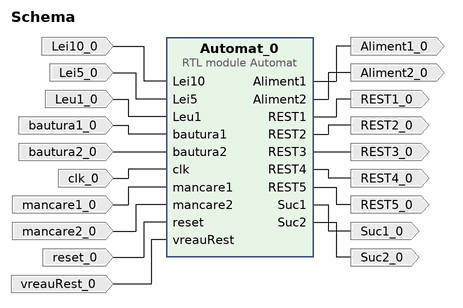
[diagram p0: block diagram of the top level]
# Vivado block design Schema, xc7a100tcsg324-1, Vivado 2020.2
create_bd_design Schema

create_bd_port -dir O Aliment1_0
create_bd_port -dir O Aliment2_0
create_bd_port -dir I Lei10_0
create_bd_port -dir I Lei5_0
create_bd_port -dir I Leu1_0
create_bd_port -dir O REST1_0
create_bd_port -dir O REST2_0
create_bd_port -dir O REST3_0
create_bd_port -dir O REST4_0
create_bd_port -dir O REST5_0
create_bd_port -dir O Suc1_0
create_bd_port -dir O Suc2_0
create_bd_port -dir I bautura1_0
create_bd_port -dir I bautura2_0
create_bd_port -dir I -type clk clk_0
create_bd_port -dir I mancare1_0
create_bd_port -dir I mancare2_0
create_bd_port -dir I -type rst reset_0
create_bd_port -dir I vreauRest_0

create_bd_cell -type module -reference Automat Automat_0

# ---- connections ----

connect_bd_net [get_bd_pins Automat_0/Aliment1] [get_bd_ports Aliment1_0]
connect_bd_net [get_bd_pins Automat_0/Aliment2] [get_bd_ports Aliment2_0]
connect_bd_net -net Lei10_0_1 [get_bd_ports Lei10_0] [get_bd_pins Automat_0/Lei10]
connect_bd_net -net Lei5_0_1 [get_bd_ports Lei5_0] [get_bd_pins Automat_0/Lei5]
connect_bd_net -net Leu1_0_1 [get_bd_ports Leu1_0] [get_bd_pins Automat_0/Leu1]
connect_bd_net [get_bd_pins Automat_0/REST1] [get_bd_ports REST1_0]
connect_bd_net [get_bd_pins Automat_0/REST2] [get_bd_ports REST2_0]
connect_bd_net [get_bd_pins Automat_0/REST3] [get_bd_ports REST3_0]
connect_bd_net [get_bd_pins Automat_0/REST4] [get_bd_ports REST4_0]
connect_bd_net [get_bd_pins Automat_0/REST5] [get_bd_ports REST5_0]
connect_bd_net [get_bd_pins Automat_0/Suc1] [get_bd_ports Suc1_0]
connect_bd_net [get_bd_pins Automat_0/Suc2] [get_bd_ports Suc2_0]
connect_bd_net -net bautura1_0_1 [get_bd_ports bautura1_0] [get_bd_pins Automat_0/bautura1]
connect_bd_net -net bautura2_0_1 [get_bd_ports bautura2_0] [get_bd_pins Automat_0/bautura2]
connect_bd_net -net clk_0_1 [get_bd_ports clk_0] [get_bd_pins Automat_0/clk]
connect_bd_net -net mancare1_0_1 [get_bd_ports mancare1_0] [get_bd_pins Automat_0/mancare1]
connect_bd_net -net mancare2_0_1 [get_bd_ports mancare2_0] [get_bd_pins Automat_0/mancare2]
connect_bd_net -net reset_0_1 [get_bd_ports reset_0] [get_bd_pins Automat_0/reset]
connect_bd_net -net vreauRest_0_1 [get_bd_ports vreauRest_0] [get_bd_pins Automat_0/vreauRest]

validate_bd_design
save_bd_design
